# Altium schematic sheet Open Reactor Control System - System Interface MCU.SchDoc: ORC - System Interface MCU
size A3; Author: Peake J; CompanyName: Scion Research; DrawnBy: Peake J; Engineer: Peake J; Organization: Scion; Address1: 49 Sala St; Address2: Whakarewarewa; Address3: Rotorua; Address4: New Zealand 3010; DocumentNumber: 0-3; Revision: 2; SheetNumber: 2; SheetTotal: 5
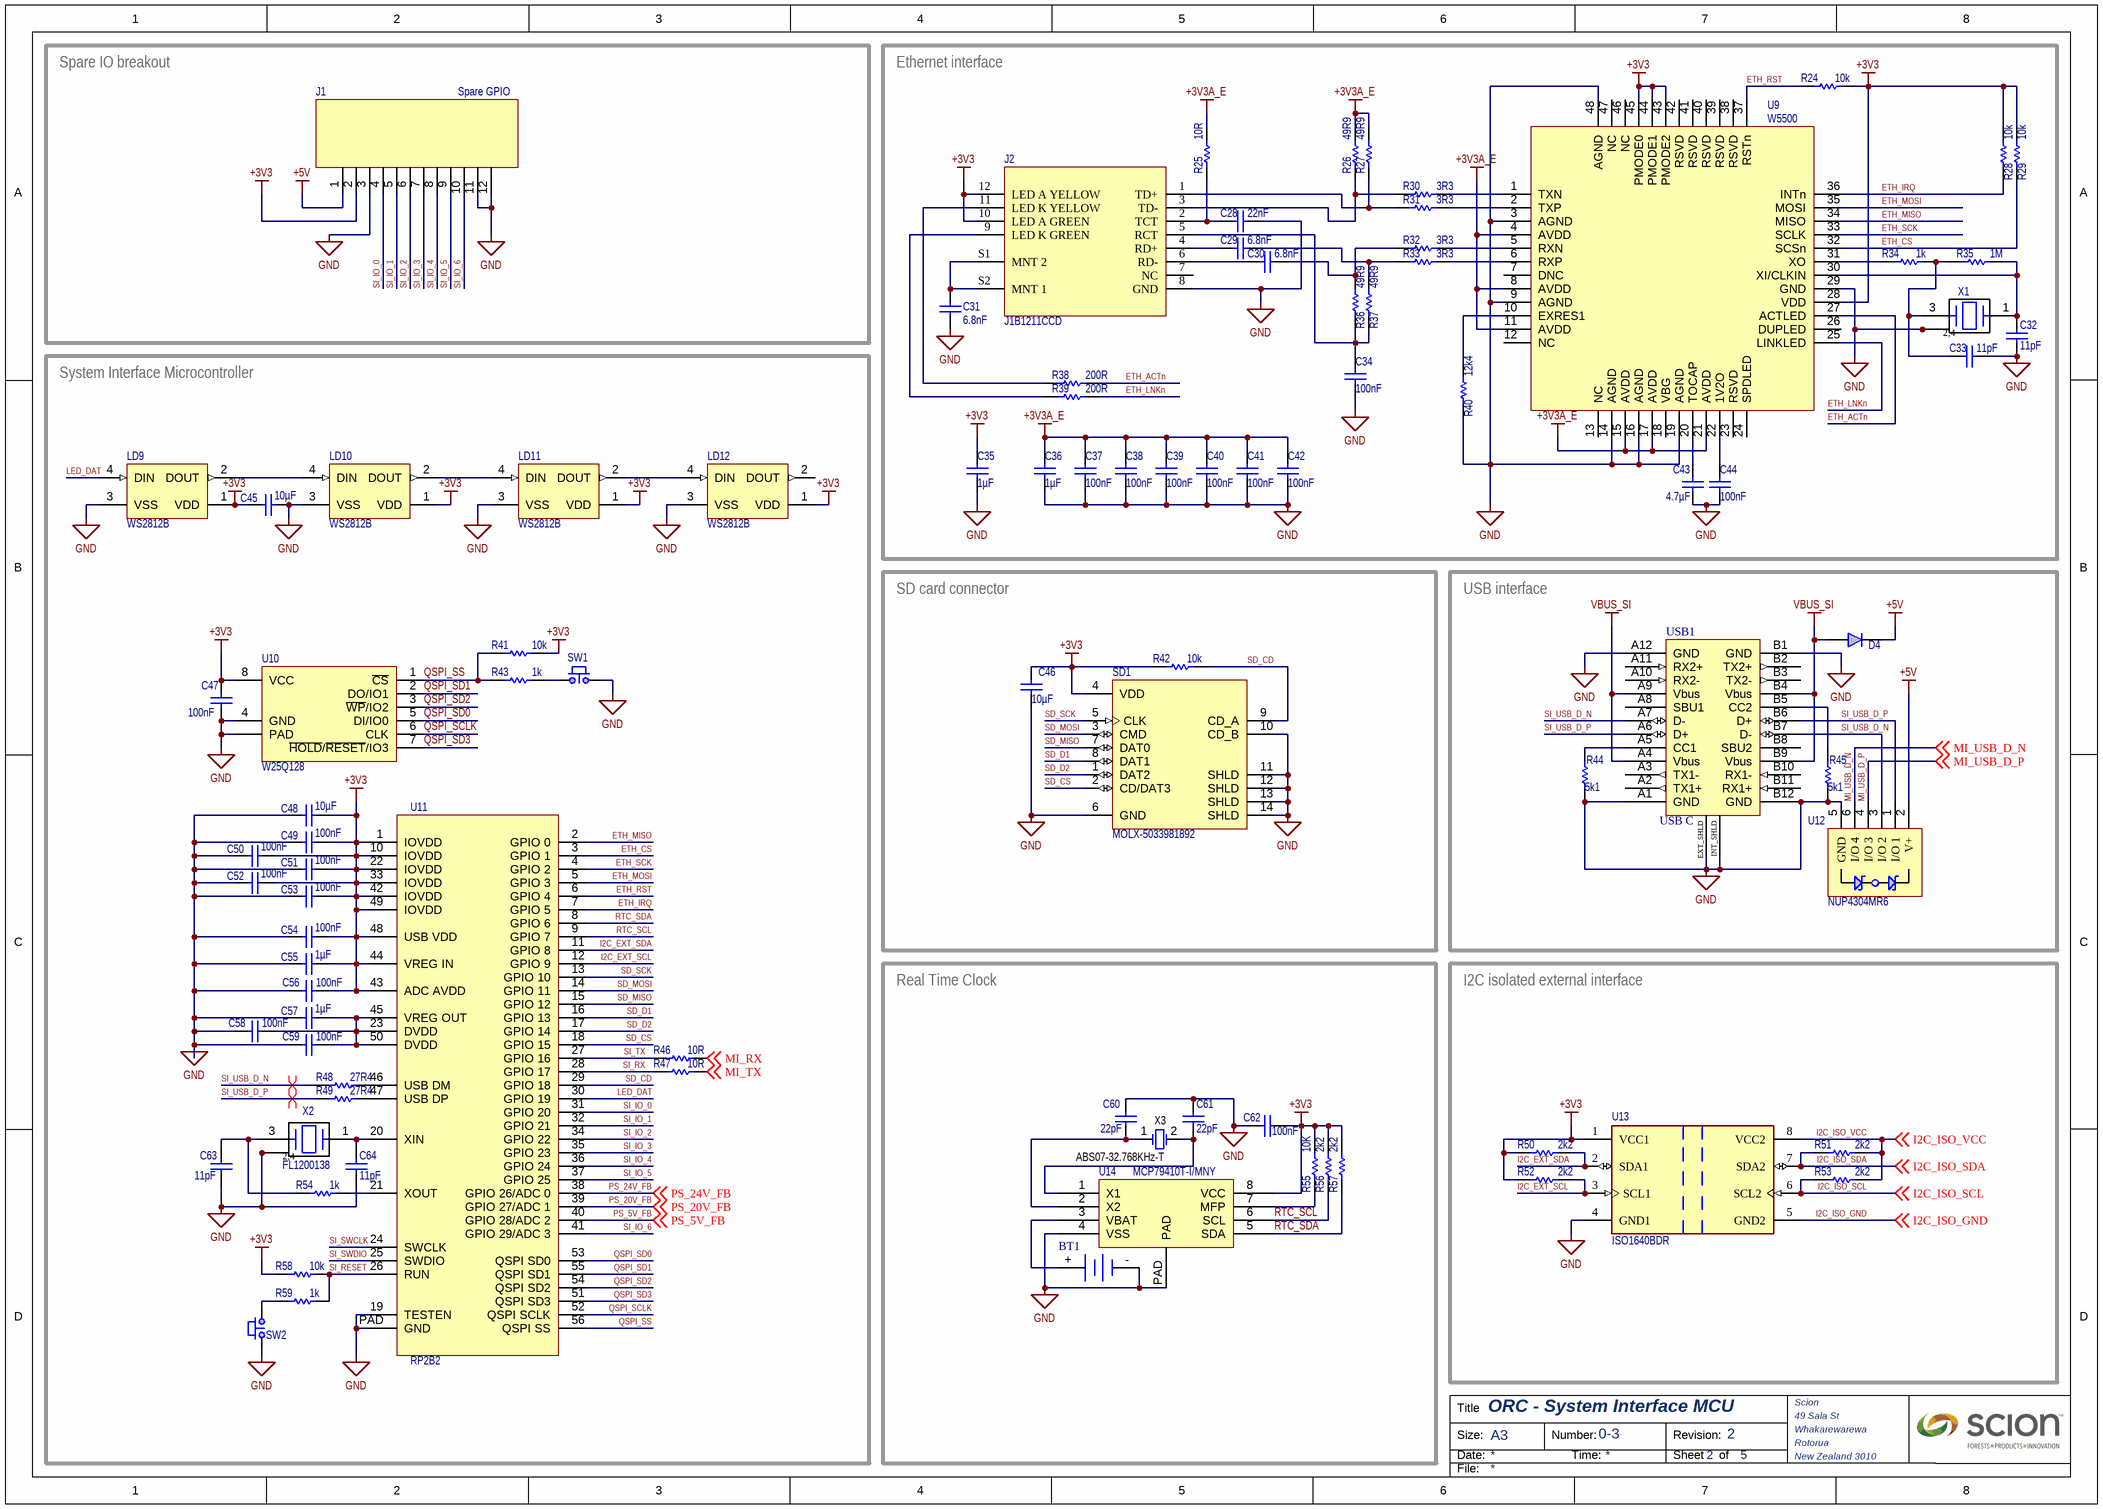
[diagram p0: Open Reactor Control System - System Interface MCU.SchDoc]

## Parts
BT1  CR2032 Batt Holder  [CR2032 Batt Holder-Footprint-1]  (value not drawn)
C28  value 22nF  [0603_CAP]  (hidden comment: Capacitor)
C29  value 6.8nF  [0603_CAP]  (hidden comment: Capacitor)
C30  value 6.8nF  [0603_CAP]  (hidden comment: Capacitor)
C31  value 6.8nF  [0603_CAP]  (hidden comment: Capacitor)
C32  value 11pF  [0603_CAP]  (hidden comment: Capacitor)
C33  value 11pF  [0603_CAP]  (hidden comment: Capacitor)
C34  value 100nF  [0603_CAP]  (hidden comment: Capacitor)
C35  value 1µF  [0402_CAP]  (hidden comment: Capacitor)
C36  value 1µF  [0402_CAP]  (hidden comment: Capacitor)
C37  value 100nF  [0402_CAP]  (hidden comment: Capacitor)
C38  value 100nF  [0402_CAP]  (hidden comment: Capacitor)
C39  value 100nF  [0402_CAP]  (hidden comment: Capacitor)
C40  value 100nF  [0402_CAP]  (hidden comment: Capacitor)
C41  value 100nF  [0402_CAP]  (hidden comment: Capacitor)
C42  value 100nF  [0402_CAP]  (hidden comment: Capacitor)
C43  value 4.7µF  [0603_CAP]  (hidden comment: Capacitor)
C44  value 100nF  [0402_CAP]  (hidden comment: Capacitor)
C45  value 10µF  [0603_CAP]  (hidden comment: Capacitor)
C46  value 10µF  [0603_CAP]  (hidden comment: Capacitor)
C47  value 100nF  [0603_CAP]  (hidden comment: Capacitor)
C48  value 10µF  [0603_CAP]  (hidden comment: Capacitor)
C49  value 100nF  [0402_CAP]  (hidden comment: Capacitor)
C50  value 100nF  [0402_CAP]  (hidden comment: Capacitor)
C51  value 100nF  [0402_CAP]  (hidden comment: Capacitor)
C52  value 100nF  [0402_CAP]  (hidden comment: Capacitor)
C53  value 100nF  [0402_CAP]  (hidden comment: Capacitor)
C54  value 100nF  [0402_CAP]  (hidden comment: Capacitor)
C55  value 1µF  [0402_CAP]  (hidden comment: Capacitor)
C56  value 100nF  [0402_CAP]  (hidden comment: CMP-001-00172-2)
C57  value 1µF  [0402_CAP]  (hidden comment: Capacitor)
C58  value 100nF  [0402_CAP]  (hidden comment: CMP-001-00172-2)
C59  value 100nF  [0402_CAP]  (hidden comment: CMP-001-00172-2)
C60  value 22pF  [0603_CAP]  (hidden comment: Capacitor)
C61  value 22pF  [0603_CAP]  (hidden comment: Capacitor)
C62  value 100nF  [0603_CAP]  (hidden comment: Capacitor)
C63  value 11pF  [0603_CAP]  (hidden comment: Capacitor)
C64  value 11pF  [0603_CAP]  (hidden comment: Capacitor)
D4  Diode  [SOD-123]  (value not drawn)
J1  Spare GPIO  [12P DIP 2.54mm male header]
J2  J1B1211CCD  [FP-J1B1211CCD-MFG]
LD9  WS2812B  [WS2812B-2020]
LD10  WS2812B  [WS2812B-2020]
LD11  WS2812B  [WS2812B-2020]
LD12  WS2812B  [WS2812B-2020]
R24  value 10k  [0603_RES]  (hidden comment: Resistor)
R25  value 10R  [0603_RES]  (hidden comment: Resistor)
R26  value 49R9  [0603_RES]  (hidden comment: Resistor)
R27  value 49R9  [0603_RES]  (hidden comment: Resistor)
R28  value 10k  [0603_RES]  (hidden comment: Resistor)
R29  value 10k  [0603_RES]  (hidden comment: Resistor)
R30  value 3R3  [0603_RES]  (hidden comment: Resistor)
R31  value 3R3  [0603_RES]  (hidden comment: Resistor)
R32  value 3R3  [0603_RES]  (hidden comment: Resistor)
R33  value 3R3  [0603_RES]  (hidden comment: Resistor)
R34  value 1k  [0603_RES]  (hidden comment: Resistor)
R35  value 1M  [0603_RES]  (hidden comment: Resistor)
R36  value 49R9  [0603_RES]  (hidden comment: Resistor)
R37  value 49R9  [0603_RES]  (hidden comment: Resistor)
R38  value 200R  [0603_RES]  (hidden comment: Resistor)
R39  value 200R  [0603_RES]  (hidden comment: Resistor)
R40  value 12k4  [0603_RES]  (hidden comment: Resistor)
R41  value 10k  [0603_RES]  (hidden comment: Resistor)
R42  value 10k  [0603_RES]  (hidden comment: Resistor)
R43  value 1k  [0603_RES]  (hidden comment: Resistor)
R44  value 5k1  [0603_RES]  (hidden comment: Resistor)
R45  value 5k1  [0603_RES]  (hidden comment: Resistor)
R46  value 10R  [0603_RES]  (hidden comment: Resistor)
R47  value 10R  [0603_RES]  (hidden comment: Resistor)
R48  value 27R4  [0603_RES]  (hidden comment: Resistor)
R49  value 27R4  [0603_RES]  (hidden comment: Resistor)
R50  value 2k2  [0603_RES]  (hidden comment: Resistor)
R51  value 2k2  [0603_RES]  (hidden comment: Resistor)
R52  value 2k2  [0603_RES]  (hidden comment: Resistor)
R53  value 2k2  [0603_RES]  (hidden comment: Resistor)
R54  value 1k  [0603_RES]  (hidden comment: Resistor)
R55  value 10K  [0603_RES]  (hidden comment: Resistor)
R56  value 2k2  [0603_RES]  (hidden comment: Resistor)
R57  value 2k2  [0603_RES]  (hidden comment: Resistor)
R58  value 10k  [0603_RES]  (hidden comment: Resistor)
R59  value 1k  [0603_RES]  (hidden comment: Resistor)
SD1  MOLX-5033981892  [MOLX-5033981892_V]
SW1  EVP-AAN02Q  [FP-EVP-AAN02Q-MFG]  (value not drawn)
SW2  EVP-AAN02Q  [FP-EVP-AAN02Q-MFG]  (value not drawn)
U9  W5500  [TSQFP50P900X900X160-48N]
U10  W25Q128  [SOIC127P790X216-8N]
U11  RP2B2  [QFN40P700X700X90_HS-57N]
U12  NUP4304MR6  [TSOP-6]
U13  ISO1640BDR  [FP-D0008A-IPC_B]
U14  MCP79410T-I/MNY  [MCP79410T-I_MNY-Footprint-1]
USB1  USB C  [GT-USB-7010ASV]
X1  ABM8-25.000MHZ-12-D1X-T  [3225 CRYSTAL 12MHz]  (value not drawn)
X2  FL1200138  [3225 CRYSTAL 12MHz]
X3  ABS07-32.768KHz-T  [ABRA-ABS07-2_V]

## Blocks framed on the sheet
Spare IO breakout: J1
Ethernet interface: C28-C44 J2 R24-R40 U9 X1
System Interface Microcontroller: C45 C47-C59 C63 C64 LD9-LD12 R41 R43 R46-R49 R54 R58 R59 SW1 SW2 U10 U11 X2
SD card connector: C46 R42 SD1
USB interface: D4 R44 R45 U12 USB1
Real Time Clock: BT1 C60-C62 R55-R57 U14 X3
I2C isolated external interface: R50-R53 U13

## Nets
+3V3: C35.2 C45.2 C46.1 C47.1 C48.1 C49.1 C50.1 C51.1 C52.1 C53.1 C54.1 C55.1 C56.2 C62.1 J1.2 J2.10(LED_A_GREEN) J2.12(LED_A_YELLOW) LD9.1(VDD) LD10.1(VDD) LD11.1(VDD) LD12.1(VDD) R24.2 R28.2 R29.2 R41.2 R42.2 R50.2 R52.2 R55.2 R56.1 R57.1 R58.2 SD1.4(VDD) U9.28(VDD) U9.43(PMODE2) U9.44(PMODE1) U9.45(PMODE0) U10.8(VCC) U11.1(IOVDD) U11.10(IOVDD) U11.22(IOVDD) U11.33(IOVDD) U11.42(IOVDD) U11.43(ADC_AVDD) U11.44(VREG_IN) U11.48(USB_VDD) U11.49(IOVDD) U13.1(VCC1) U14.8(VCC)
+3V3A_E: C36.2 C37.2 C38.2 C39.2 C40.2 C41.2 C42.2 R25.2 R26.2 R27.2 U9.4(AVDD) U9.8(AVDD) U9.11(AVDD) U9.15(AVDD) U9.17(AVDD) U9.21(AVDD)
+5V: D4.1(K) J1.1 U12.2(V+)
GND: BT1.- C28.1 C31.2 C32.2 C33.2 C34.1 C35.1 C36.1 C37.1 C38.1 C39.1 C40.1 C41.1 C42.1 C43.1 C44.1 C45.1 C46.2 C47.2 C48.2 C49.2 C50.2 C51.2 C52.2 C53.2 C54.2 C55.2 C56.1 C57.2 C58.1 C59.1 C60.2 C61.2 C62.2 C63.2 C64.2 J1.3 J1.11 J1.12 J2.8(GND) LD9.3(VSS) LD10.3(VSS) LD11.3(VSS) LD12.3(VSS) R40.1 R44.2 R45.2 SD1.6(GND) SD1.10(CD_B) SD1.11(SHLD) SD1.12(SHLD) SD1.13(SHLD) SD1.14(SHLD) SW1.2 SW2.1 U9.3(AGND) U9.9(AGND) U9.14(AGND) U9.16(AGND) U9.19(AGND) U9.29(GND) U9.48(AGND) U10.4(GND) U10.PAD U11.19(TESTEN) U11.PAD(GND) U12.5(GND) U13.4(GND1) U14.4(VSS) U14.PAD USB1.A1(GND) USB1.A12(GND) USB1.B1(GND) USB1.B12(GND) USB1.EXT_SHLD USB1.INT_SHLD X1.2(GND) X1.4(GND) X2.2(GND) X2.4(GND)
VBUS_SI: D4.2(A) USB1.A4(Vbus) USB1.A9(Vbus) USB1.B4(Vbus) USB1.B9(Vbus)
ETH_ACTn: R38.2 U9.27(ACTLED)
ETH_CS: R29.1 U9.32(SCSn) U11.3(GPIO_1)
ETH_IRQ: R28.1 U9.36(INTn) U11.7(GPIO_5)
ETH_LNKn: R39.2 U9.25(LINKLED)
ETH_MISO: U9.34(MISO) U11.2(GPIO_0)
ETH_MOSI: U9.35(MOSI) U11.5(GPIO_3)
ETH_RST: R24.1 U9.37(RSTn) U11.6(GPIO_4)
ETH_SCK: U9.33(SCLK) U11.4(GPIO_2)
I2C_EXT_SCL: R52.1 U11.12(GPIO_9) U13.3(SCL1)
I2C_EXT_SDA: R50.1 U11.11(GPIO_8) U13.2(SDA1)
I2C_ISO_GND: U13.5(GND2) ; off-sheet I2C_ISO_GND
I2C_ISO_SCL: R53.2 U13.6(SCL2) ; off-sheet I2C_ISO_SCL
I2C_ISO_SDA: R51.2 U13.7(SDA2) ; off-sheet I2C_ISO_SDA
I2C_ISO_VCC: R51.1 R53.1 U13.8(VCC2) ; off-sheet I2C_ISO_VCC
LED_DAT: LD9.4(DIN) U11.30(GPIO_19)
MI_RX: R46.1 ; off-sheet MI_RX
MI_TX: R47.1 ; off-sheet MI_TX
MI_USB_D_N: U12.6(I/O_4) ; off-sheet MI_USB_D_N
MI_USB_D_P: U12.4(I/O_3) ; off-sheet MI_USB_D_P
PS_5V_FB: U11.40(GPIO_28/ADC_2) ; off-sheet PS_5V_FB
PS_20V_FB: U11.39(GPIO_27/ADC_1) ; off-sheet PS_20V_FB
PS_24V_FB: U11.38(GPIO_26/ADC_0) ; off-sheet PS_24V_FB
QSPI_SCLK: U10.6(CLK) U11.52(QSPI_SCLK)
QSPI_SD0: U10.5(DI/IO0) U11.53(QSPI_SD0)
QSPI_SD1: U10.2(DO/IO1) U11.55(QSPI_SD1)
QSPI_SD2: U10.3(~{WP}/IO2) U11.54(QSPI_SD2)
QSPI_SD3: U10.7(~{HOLD}/~{RESET}/IO3) U11.51(QSPI_SD3)
QSPI_SS: R41.1 R43.2 U10.1(~{CS}) U11.56(QSPI_SS)
RTC_SCL: R56.2 U11.9(GPIO_7) U14.6(SCL)
RTC_SDA: R57.2 U11.8(GPIO_6) U14.5(SDA)
SD_CD: R42.1 SD1.9(CD_A) U11.29(GPIO_18)
SD_CS: SD1.2(CD/DAT3) U11.18(GPIO_15)
SD_D1: SD1.8(DAT1) U11.16(GPIO_13)
SD_D2: SD1.1(DAT2) U11.17(GPIO_14)
SD_MISO: SD1.7(DAT0) U11.15(GPIO_12)
SD_MOSI: SD1.3(CMD) U11.14(GPIO_11)
SD_SCK: SD1.5(CLK) U11.13(GPIO_10)
SI_IO_0: J1.4 U11.31(GPIO_20)
SI_IO_1: J1.5 U11.32(GPIO_21)
SI_IO_2: J1.6 U11.34(GPIO_22)
SI_IO_3: J1.7 U11.35(GPIO_23)
SI_IO_4: J1.8 U11.36(GPIO_24)
SI_IO_5: J1.9 U11.37(GPIO_25)
SI_IO_6: J1.10 U11.41(GPIO_29/ADC_3)
SI_RESET: R58.1 R59.1 U11.26(RUN)
SI_RX: R47.2 U11.28(GPIO_17)
SI_SWCLK: U11.24(SWCLK)
SI_SWDIO: U11.25(SWDIO)
SI_TX: R46.2 U11.27(GPIO_16)
SI_USB_D_N: R48.1 U12.3(I/O_2) USB1.A7(D-) USB1.B7(D-)
SI_USB_D_P: R49.1 U12.1(I/O_1) USB1.A6(D+) USB1.B6(D+)
NetBT1_+: BT1.+ U14.3(VBAT)
NetC28_2: C28.2 J2.2(TCT) R25.1
NetC29_1: C29.1 R33.1 R37.2
NetC29_2: C29.2 J2.4(RD+)
NetC30_1: C30.1 R32.1 R36.2
NetC30_2: C30.2 J2.6(RD-)
NetC31_1: C31.1 J2.S1(MNT_2) J2.S2(MNT_1)
NetC32_1: C32.1 R35.2 U9.30(XI/CLKIN) X1.1(XT)
NetC33_1: C33.1 R34.2 R35.1 X1.3(XT)
NetC34_2: C34.2 J2.5(RCT) R36.1 R37.1
NetC43_2: C43.2 U9.20(TOCAP)
NetC44_2: C44.2 U9.22(1V2O)
NetC57_1: C57.1 C58.2 C59.2 U11.23(DVDD) U11.45(VREG_OUT) U11.50(DVDD)
NetC60_1: C60.1 U14.2(X2) X3.1(OSC1)
NetC61_1: C61.1 U14.1(X1) X3.2(OSC2)
NetC63_1: C63.1 R54.1 X2.3(XT)
NetC64_1: C64.1 U11.20(XIN) X2.1(XT)
NetJ2_1: J2.1(TD+) R27.1 R31.1
NetJ2_3: J2.3(TD-) R26.1 R30.1
NetJ2_9: J2.9(LED_K_GREEN) R39.1
NetJ2_11: J2.11(LED_K_YELLOW) R38.1
NetLD9_2: LD9.2(DOUT) LD10.4(DIN)
NetLD10_2: LD10.2(DOUT) LD11.4(DIN)
NetLD11_2: LD11.2(DOUT) LD12.4(DIN)
NetR30_2: R30.2 U9.1(TXN)
NetR31_2: R31.2 U9.2(TXP)
NetR32_2: R32.2 U9.5(RXN)
NetR33_2: R33.2 U9.6(RXP)
NetR34_1: R34.1 U9.31(XO)
NetR40_2: R40.2 U9.10(EXRES1)
NetR43_1: R43.1 SW1.1
NetR44_1: R44.1 USB1.A5(CC1)
NetR45_1: R45.1 USB1.B5(CC2)
NetR48_2: R48.2 U11.46(USB_DM)
NetR49_2: R49.2 U11.47(USB_DP)
NetR54_2: R54.2 U11.21(XOUT)
NetR55_1: R55.1 U14.7(MFP)
NetR59_2: R59.2 SW2.2

Not connected (* = marked no-connect by the designer): J2 7(NC); LD12 2(DOUT); U9 7(DNC) 12(NC) 13(NC) 18(VBG) 23(RSVD) 24(SPDLED) 26(DUPLED) 38(RSVD) 39(RSVD) 40(RSVD) 41(RSVD) 42(RSVD) 46(NC) 47(NC); USB1 A2(TX1+) A3(TX1-) A8(SBU1) A10(RX2-) A11(RX2+) B2(TX2+) B3(TX2-) B8(SBU2) B10(RX1-) B11(RX1+)

## Layout directives
differential pair: SI_USB_D_N, SI_USB_D_P

## Notes on the sheet
- Title
- Size:
- Date:
- A3
- Number:
- Time:
- Revision:
- Sheet
- of
- File:
- (in symbol CMP-003-00068-2) 2,4

## Library data of the parts
BT1 = CMP-079-000035-3: SMD CR2032 coin cell holder; Component Type: Standard; Pin Count: 2; Source: All Components - 30.06.23 - 18.27.SchLib; Design Item ID: CMP-00042-2
C28-C59 C63 C64 = CMP-001-00172-2: SMD Capacitor; Pins: 2; Source: Discrete.SchLib; Design Item ID: Capacitor; Component Type: Standard
C60-C62 = CMP-001-00172-1: SMD Capacitor; Pins: 2; Source: Discrete.SchLib; Component Type: Standard; Design Item ID: Capacitor
D4 = CMP-004-00083-4: SMD Diode; Design Item ID: Diode; Pins: 2; Source: Discrete.SchLib; Component Type: Standard; Pin Count: 2
J1 = CMP-002-00171-6: 12 Pin Connector; Design Item ID: 12_Pin; Source: Connectors.SchLib; Component Type: Standard; Pins: 12; Pin Count: 12
J2 = CMP-002-00002-1: Telecom and Datacom Connector, 8 Contact(s), Female, Right Angle, Solder Terminal, Locking
LD9-LD12 = CMP-079-000113-2: Intelligent Control LED Integrated Light Source, 3.5 to 5.3 V, -25 to 80 degC, 4-Pin SMD, RoHS, Bulk; Manufacturer: Adafruit Industries; Mounting Technology: SM; RoHS Compliant: False; Package Reference: WS2812B; Case/Package: WS2812B; Component Type: Standard; Manufacturer URL: https://www.adafruit.com/; Package Description: 4-Pin Surface Mount Device, Body 5 x 5 mm, Pitch 3.3 mm; Source: All Components - 30.06.23 - 18.27.SchLib; Datasheet Version: May-13; Datasheet URL: https://cdn-shop.adafruit.com/datasheets/WS2812B.pdf; Pin Count: 4; Design Item ID: CMP-007-00035-3
R24-R37 R40-R43 R46 R47 R50-R59 = CMP-009-00356-1: SMD Resistor; Pins: 2; Source: Discrete.SchLib; Component Type: Standard; Design Item ID: Resistor
R38 R39 = CMP-009-00356-1: SMD Resistor; Value: 200R; Pins: 2; Source: Discrete.SchLib; Component Type: Standard; Design Item ID: Resistor
R44 R45 = CMP-009-00356-1: SMD Resistor; Value: 5k1; Pins: 2; Source: Discrete.SchLib; Component Type: Standard; Design Item ID: Resistor
R48 R49 = CMP-009-00356-1: SMD Resistor; Value: 27R4; Pins: 2; Source: Discrete.SchLib; Component Type: Standard; Design Item ID: Resistor
SD1 = CMP-079-000062-1: Micro SD Card Connector, Pitch 1.1 mm, 8 Position, Height 1.4 mm, -25 to 85 degC, RoHS, Tape and Reel; Source: All Components - 30.06.23 - 18.27.SchLib; Pins: 14; Design Item ID: CMP-002-00049-5; Component Type: Standard; Pin Count: 14
SW1 SW2 = CMP-011-00000-2: Switch Tactile N.O. SPST Rectangular Button J-Bend 0.02A 15VDC 100000Cycles 5N SMD T/R
U9 = CMP-015-00003-1: Microprocessor Circuit, CMOS, PQFP48; Max Supply Voltage: 3.63V; Nominal Supply Voltage: 3.3V; Min Supply Voltage: 2.97V; Case/Package: LFQFP; Max Operating Temperature: 85°C; Pins: 48; RoHS Compliant: Yes; Min Operating Temperature: -40°C
U10 = CMP-019-00000-2: W25Q16-256 SPI flash module
U11 = CMP-020-00000-3: RP2040 Arm Cortex M0+ Dual Core MCU
U12 = CMP-079-000096-2: ESD Protection Doide Array; Design Item ID: NUP4304MR6; Pin Count: 6; Component Type: Standard; Source: ON Semi.SchLib
U13 = CMP-015-00009-1: Interface Circuit, PDSO8; RoHS Compliant: Yes
U14 = CMP-00029-00016-2: Real Time Clock Serial 64byte Clock/Calendar/Alarm/Battery Backup Automotive 8-Pin TDFN EP T/R; Max Supply Voltage: 5.5V; Min Supply Voltage: 1.8V; Interface: I2C,Serial,2-Wire; Time Format: HH:MM:SS; Memory Size: 64B; Date Format: YY-MM-DD-dd; Lead Free: Lead Free; Case/Package: DFN; Weight: 0.001319oz; Length: 0.078inch; Max Operating Temperature: 85°C; Radiation Hardening: No; Packaging: Tape and Reel; Mount: Surface Mount; Package Quantity: 3300; Width: 0.118inch; Supply Voltage-Nom: 5.5V; Height: 0.03inch; Min Operating Temperature: -40°C; Logic Function: Clock; RoHS Compliant: Yes; Design Item ID: CMP-00046-1; Component Type: Standard; Source: All Components - 30.06.23 - 18.27.SchLib; Pins: 8; Pin Count: 9
USB1 = CMP-079-000004-4: Vertical or RA Type C Usb Connector Rohs Compliant: Yes; Pin Count: 26; Design Item ID: CMP-00005-5; Source: All Components - 30.06.23 - 18.27.SchLib; Component Type: Standard
X1 X2 = CMP-003-00068-2: SMD Crystal; Design Item ID: Crystal; Pins: 4; Component Type: Standard; Source: Discrete.SchLib
X3 = CMP-003-00061-3: Low Profile Crystal, 32.768 kHz, +/- 20 ppm, 12.5 pF, -40 to 85 degC, 2-Pin SMD, Pb-Free, Tape and Reel; Manufacturer: Abracon; Tolerance: 20ppm; Load Capacitance: 12.5pF; ESR: 70k; Case/Package: CSMD; Datasheet Version: Aug-15; Pins: 2; Max Operating Temperature: 85°C; Package Description: 2-Pin Surface Mount Device, Body 3.2 x 1.5 mm; Manufacturer URL: http://www.abracon.com/; Package URL: http://www.abracon.com/Support/PackageDrawing/Resonators/ABS07.PDF; Min Operating Temperature: -40°C; Packaging: TapeandReel; RoHS Compliant: True; Package Reference: ABS07-2; Frequency Tolerance: 20ppm; Frequency: 32.768kHz; Datasheet URL: http://www.abracon.com/Resonators/ABS07.pdf; Package Quantity: 3000; Mounting Technology: SM; Component Type: Standard; Source: All Components - 30.06.23 - 18.27.SchLib; Design Item ID: CMP-003-00022-1